# EAGLE design puenteh (EAGLE 5.07)
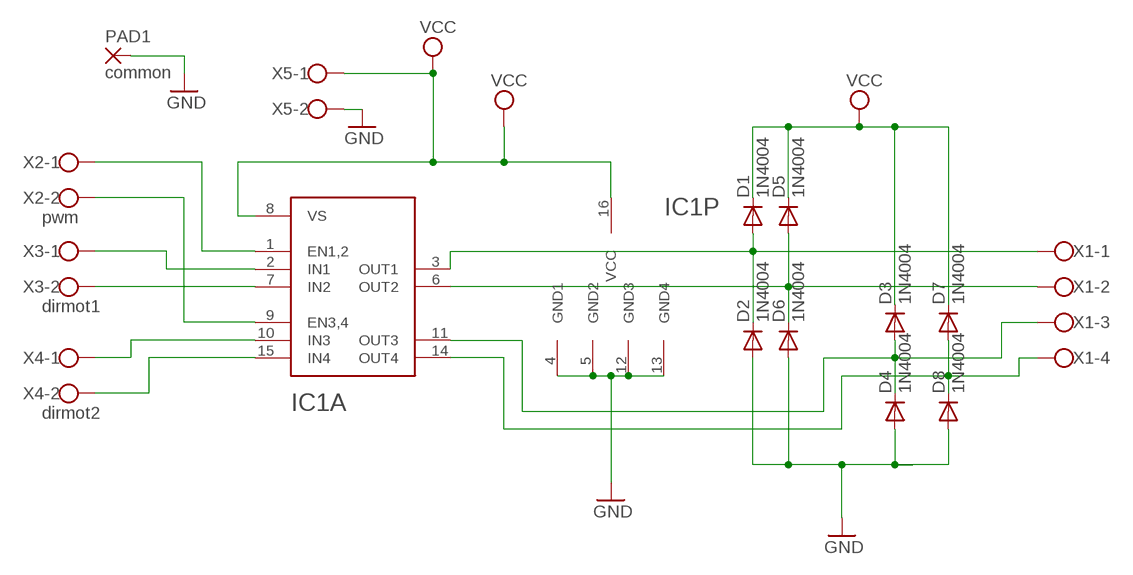
[diagram p0: schematic, sheet 1]

## Parts
D1  1N4004  [DO41-10]
D2  1N4004  [DO41-10]
D3  1N4004  [DO41-10]
D4  1N4004  [DO41-10]
D5  1N4004  [DO41-10]
D6  1N4004  [DO41-10]
D7  1N4004  [DO41-10]
D8  1N4004  [DO41-10]
IC1  L293D  [DIP16]
PAD1  common  2,54/0,8  [2,54/0,8]
X1  W237-4  [W237-4]
X2  pwm  W237-102  [W237-102]
X3  dirmot1  W237-102  [W237-102]
X4  dirmot2  W237-102  [W237-102]
X5  W237-102  [W237-102]

## Nets
GND: D2.A D4.A D6.A D8.A IC1.4(P:GND1) IC1.5(P:GND2) IC1.12(P:GND3) IC1.13(P:GND4) PAD1.1(P) X5.2
N$1: IC1.1(A:EN1,2) X2.1
N$2: D5.A D6.C IC1.6(A:OUT2) X1.2
N$4: IC1.2(A:IN1) X3.1
N$5: IC1.7(A:IN2) X3.2
N$6: IC1.10(A:IN3) X4.1
N$7: IC1.15(A:IN4) X4.2
N$8: D3.A D4.C IC1.11(A:OUT3) X1.3
N$9: D1.A D2.C IC1.3(A:OUT1) X1.1
N$10: D7.A D8.C IC1.14(A:OUT4) X1.4
PWM: IC1.9(A:EN3,4) X2.2
VCC: D1.C D3.C D5.C D7.C IC1.8(A:VS) IC1.16(P:VCC) X5.1

## Library data of the parts
D1-D8 = diode:1N4004: DIODE general purpose rectifier, 1 A
IC1 = ADS:L293D: L293D Quad Half H-Bridge with integrated diodes
PAD1 = wirepad:2,54/0,8: THROUGH-HOLE PAD
X1 = con-wago-500:W237-4: WAGO SCREW CLAMP
X2-X5 = con-wago-500:W237-102: WAGO SCREW CLAMP

## Board
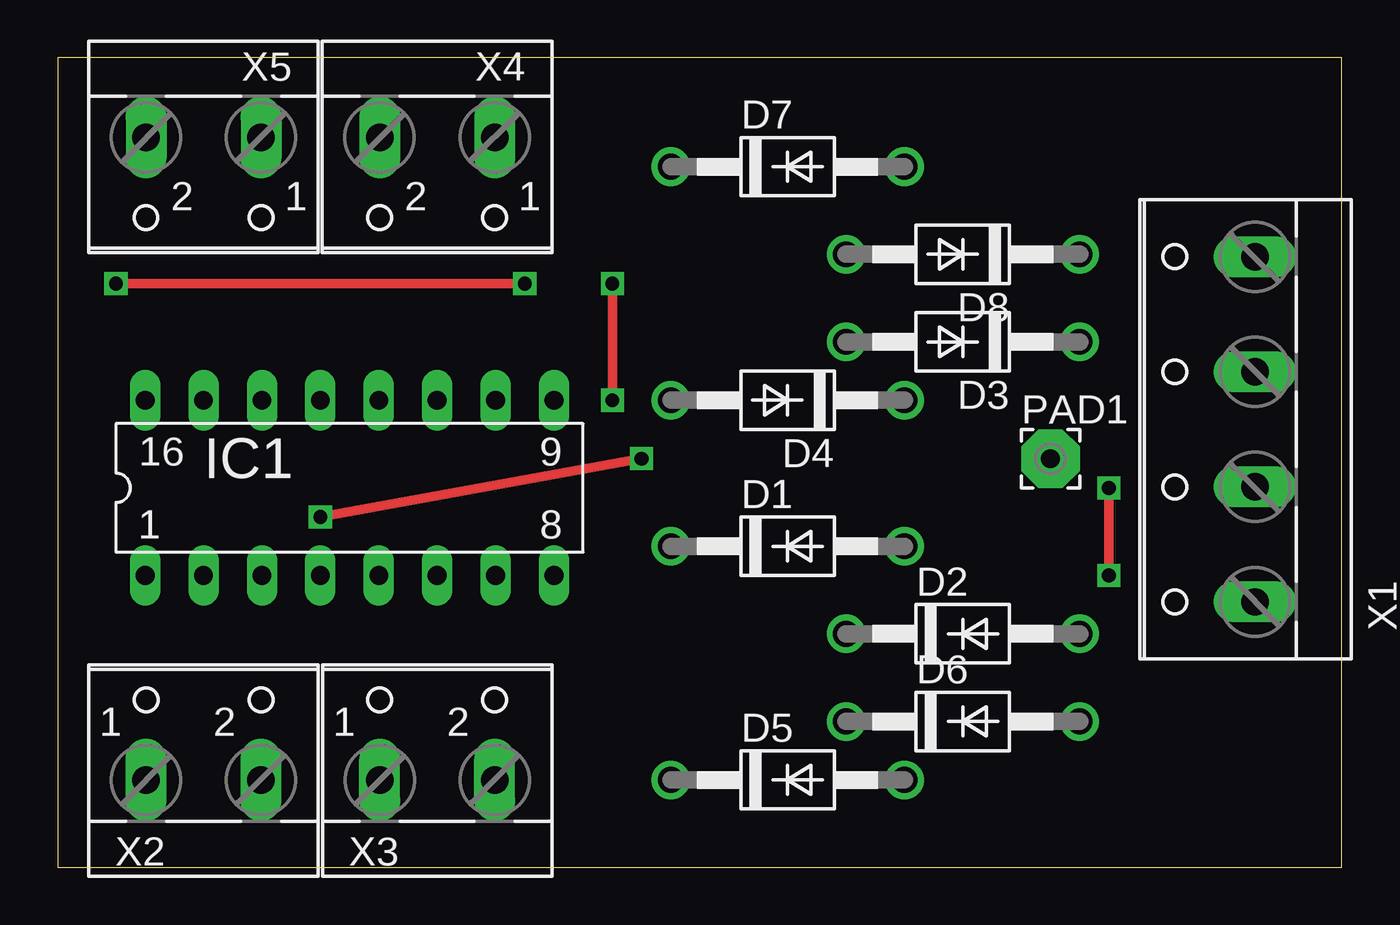
[diagram p1: board, top side]
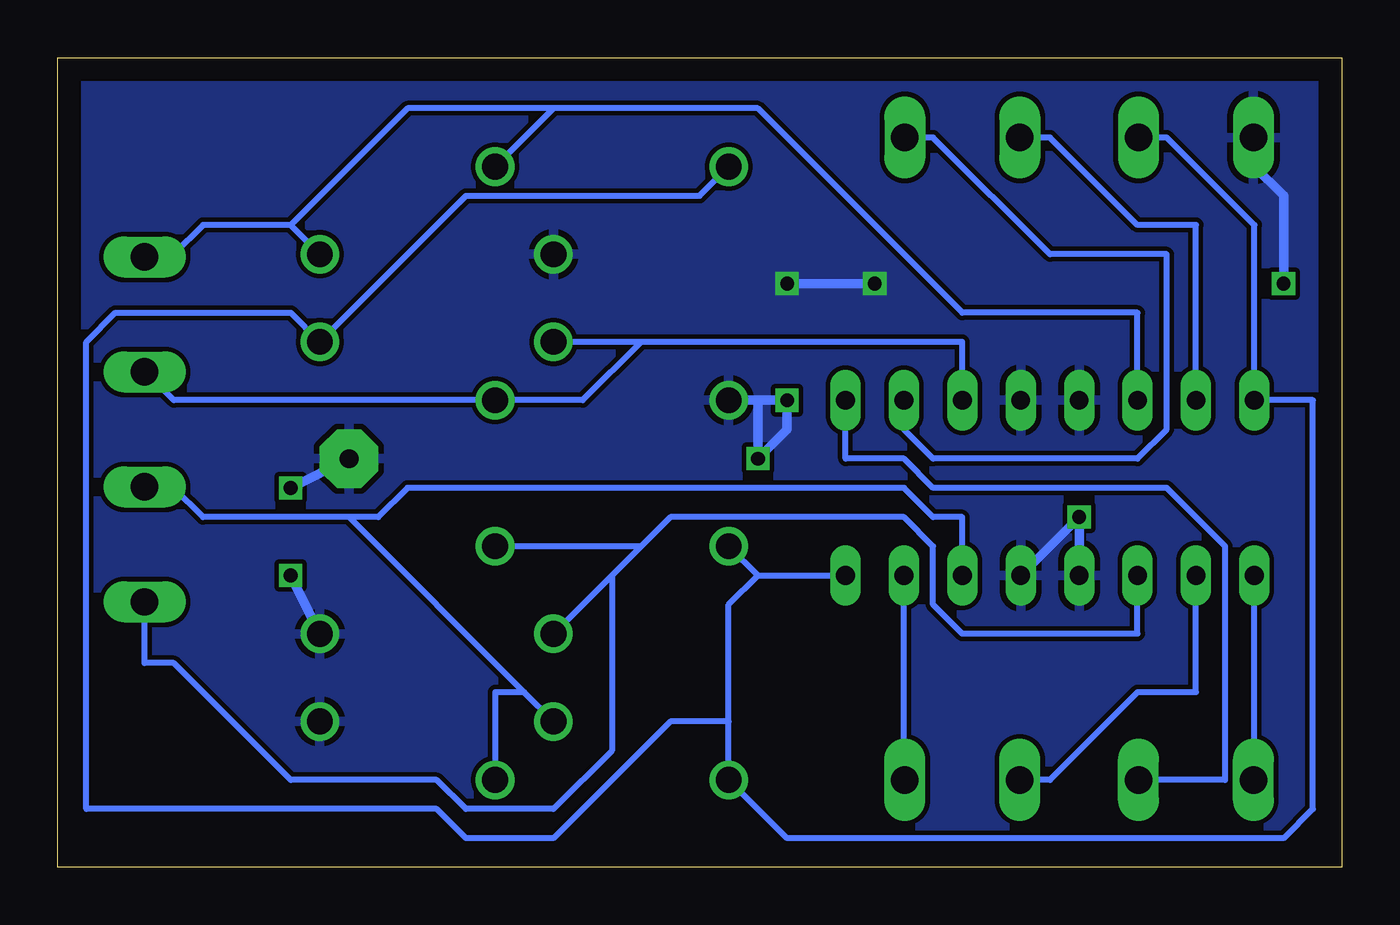
[diagram p2: board, bottom side, seen from below]

Size 55.86 x 35.23 mm. Coordinates in mm from the lower left corner, seen from the top.
Outline: 0,0 55.86,0 55.86,35.23 0,35.23 0,0
Copper layers (1*16): Top 0.035mm / dielectric 1.5mm / Bottom 0.035mm
Design rules "default": minimum track width 10mil, minimum drill 24mil, track to track 8mil, track to pad 8mil, pad to pad 8mil, via to via 8mil, smd to smd 8mil, copper to edge 40mil, drill to drill 8mil, minimum pad ring 10mil, minimum via ring 8mil, stop-mask expansion 4mil, vias tented up to drill 0mil, thermal gap 10mil

### Footprints (pad centres in the part's own frame; a part is rotated, then mirrored left to right if it is on the bottom)
DO41-10 = drill 1.118 round: A 5.08,0; C -5.08,0
DIP16 = drill 0.813 long: 1 -8.89,-3.81; 2 -6.35,-3.81; 3 -3.81,-3.81; 4 -1.27,-3.81; 5 1.27,-3.81; 6 3.81,-3.81; 7 6.35,-3.81; 8 8.89,-3.81; 9 8.89,3.81; 10 6.35,3.81; 11 3.81,3.81; 12 1.27,3.81; 13 -1.27,3.81; 14 -3.81,3.81; 15 -6.35,3.81; 16 -8.89,3.81
2,54/0,8 = drill 0.813 pad 2.54 octagon: 1 0,0
W237-4 = drill 1.194 long: 1 -7.5,-1.27; 2 -2.5,-1.27; 3 2.5,-1.27; 4 7.5,-1.27
W237-102 = drill 1.194 long: 1 -2.5,-1.27; 2 2.5,-1.27

### Placement (x,y rotation side)
D1  31.75,13.97 0 top
D2  39.37,10.16 0 top
D3  39.37,22.86 180 top
D4  31.75,20.32 180 top
D5  31.75,3.81 0 top
D6  39.37,6.35 0 top
D7  31.75,30.48 0 top
D8  39.37,26.67 180 top
IC1  12.7,16.51 0 top
PAD1  43.18,17.78 0 top
X1  50.8,19.05 90 top
X2  6.35,5.08 0 top
X3  16.51,5.08 0 top
X4  16.51,30.48 180 top
X5  6.35,30.48 180 top

### Tracks (layer width: path | path; a pad name or v marks a point on that pad's centre or on a via)
GND  (via drill 0.6)
  Top 0.406: v20.32,25.4 v2.54,25.4 | v45.72,12.7 v45.72,16.51 | v24.13,20.32 v24.13,25.4 | v25.4,17.78 v11.43,15.24
  Bottom 0.406: X5.2 3.85,30.52 2.54,29.21 v2.54,25.4 | 25.4,20.32 v24.13,20.32 24.13,19.05 v25.4,17.78 25.4,20.32 | 25.4,20.32 D4.A | IC1.4 v11.43,15.24 IC1.5 | D2.A v45.72,12.7 | v45.72,16.51 PAD1.1 | v24.13,25.4 v20.32,25.4
  pour Bottom: 0,35.56 55.88,35.56 55.88,0 0,0
N$1
  Bottom 0.254: IC1.1 3.81,3.81 X2.1
N$2
  Bottom 0.254: IC1.6 16.51,15.24 17.78,15.24 19.05,16.51 40.64,16.51 41.91,15.24 43.18,15.24 | 43.18,15.24 49.53,15.24 50.8,16.51 52.07,16.51 X1.2 | 43.18,15.24 35.56,7.62 | 35.56,7.62 D6.C | D5.A 36.83,7.62 35.56,7.62
N$4
  Bottom 0.254: IC1.2 6.35,7.62 8.89,7.62 12.7,3.81 X3.1
N$5
  Bottom 0.254: IC1.7 19.05,3.81 X3.2
N$6
  Bottom 0.254: IC1.10 19.05,19.05 17.78,17.78 8.89,17.78 7.62,19.05 7.62,26.67 12.7,26.67 17.78,31.75 X4.1 19.05,31.75
N$7
  Bottom 0.254: IC1.15 6.35,27.94 8.89,27.94 12.7,31.75 X4.2
N$8
  Bottom 0.254: IC1.11 16.51,22.86 30.48,22.86 | 30.48,22.86 D3.A | 30.48,22.86 33.02,20.32 D4.C 50.8,20.32 52.07,21.59 X1.3
N$9
  Bottom 0.254: IC1.3 8.89,10.16 16.51,10.16 17.78,11.43 17.78,13.97 19.05,15.24 29.21,15.24 30.48,13.97 | 31.75,12.7 D2.C | 30.48,13.97 31.75,12.7 | 30.48,13.97 D1.A | 31.75,12.7 31.75,5.08 34.29,2.54 38.1,2.54 39.37,3.81 45.72,3.81 50.8,8.89 52.07,8.89 X1.1
N$10
  Bottom 0.254: 45.72,27.94 D8.C | 45.72,27.94 49.53,27.94 50.8,26.67 52.07,26.67 X1.4 | IC1.14 8.89,24.13 16.51,24.13 25.4,33.02 34.29,33.02 | 34.29,33.02 D7.A | 45.72,27.94 40.64,33.02 34.29,33.02
N$21  (via drill 0.6)
  other vias: 2.54,25.4
N$24  (via drill 0.6)
  other vias: 24.13,20.32
N$25  (via drill 0.6)
  other vias: 45.72,12.7
N$26  (via drill 0.6)
  other vias: 45.72,16.51
N$28  (via drill 0.6)
  other vias: 11.43,15.24
N$29  (via drill 0.6)
  other vias: 25.4,17.78
PWM
  Bottom 0.254: IC1.9 21.59,17.78 19.05,17.78 17.78,16.51 7.62,16.51 5.08,13.97 5.08,3.81 X2.2 8.89,3.81
VCC
  Bottom 0.254: D7.C 27.94,29.21 38.1,29.21 D3.C 45.72,24.13 53.34,24.13 54.61,22.86 54.61,2.54 39.37,2.54 38.1,1.27 34.29,1.27 29.21,6.35 26.67,6.35 | 25.4,12.7 IC1.8 | 25.4,12.7 D1.C | 26.67,6.35 26.67,11.43 25.4,12.7 | 26.67,6.35 D5.C 24.13,1.27 2.54,1.27 1.27,2.54 1.27,20.32 IC1.16 3.81,27.94 7.62,31.75 X5.1 8.89,31.75